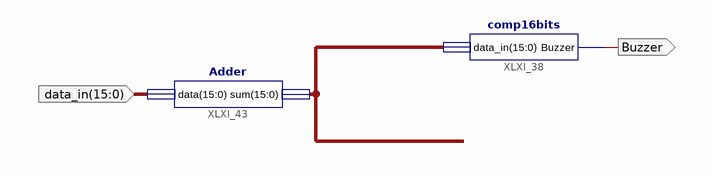
[diagram p0: schematic sheet 1]
// Xilinx ISE schematic adder_8bits.sch (spartan6) as structural Verilog: 2 symbols, 2 ports
module adder_8bits (
  input  [15:0] data_in,
  output Buzzer
);

  wire [15:0] XLXN_226;

  comp16bits XLXI_38 (.Buzzer(Buzzer), .data_in(XLXN_226));
  Adder XLXI_43 (.data(data_in), .sum(XLXN_226));
endmodule
